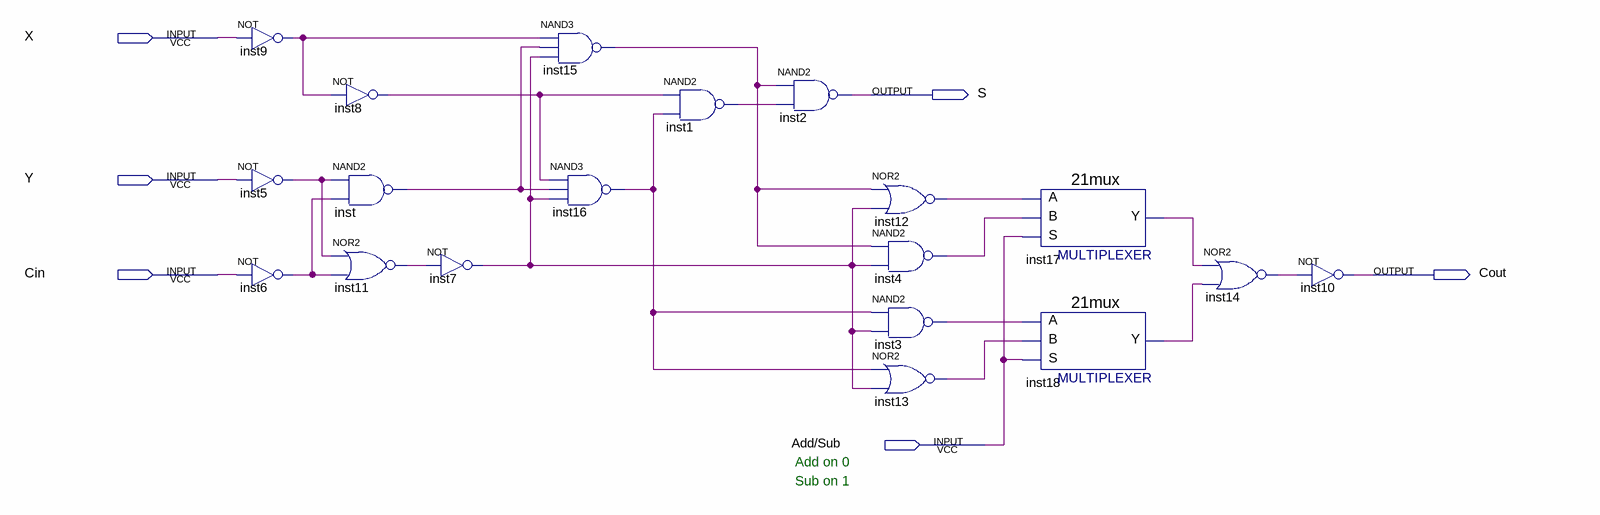
[diagram p0: schematic sheet]
// Quartus schematic AdderSubtractor.bdf as structural Verilog: 19 symbols, 6 pins
module AdderSubtractor (
  input  X,
  input  Y,
  input  Cin,
  input  \Add/Sub ,
  output S,
  output Cout
);

  wire inst1_out, inst3_out, inst4_out, inst5_out, inst6_out, inst7_out, inst8_out, inst9_out, inst11_out,
       inst12_out, inst13_out, inst14_out, inst15_out, inst16_out, inst17_y, inst18_y, inst_out;

  not inst9 (inst9_out, X);
  not inst5 (inst5_out, Y);
  not inst6 (inst6_out, Cin);
  not inst8 (inst8_out, inst9_out);
  nand inst (inst_out, inst5_out, inst6_out);
  nor inst11 (inst11_out, inst5_out, inst6_out);
  not inst7 (inst7_out, inst11_out);
  nand inst15 (inst15_out, inst9_out, inst_out, inst7_out);
  nand inst16 (inst16_out, inst8_out, inst_out, inst7_out);
  nand inst1 (inst1_out, inst8_out, inst16_out);
  nand inst2 (S, inst15_out, inst1_out);
  nor inst12 (inst12_out, inst15_out, inst7_out);
  nand inst4 (inst4_out, inst15_out, inst7_out);
  nand inst3 (inst3_out, inst16_out, inst7_out);
  nor inst13 (inst13_out, inst16_out, inst7_out);
  \21mux  inst17 (.S(\Add/Sub ), .B(inst4_out), .A(inst12_out), .Y(inst17_y));
  \21mux  inst18 (.S(\Add/Sub ), .B(inst13_out), .A(inst3_out), .Y(inst18_y));
  nor inst14 (inst14_out, inst17_y, inst18_y);
  not inst10 (Cout, inst14_out);

  // Notes on the sheet:
  //   Add on 0
  //   Sub on 1
endmodule
